# Altium schematic sheet HDA_Connectors.SchDoc: Apalis Evaluation Board 1.1
size A3; Organization: Toradex AG; Address1: Altsagenstrasse 5; Address2: Horw; Address3: 6048; Address4: Switzerland; DocumentNumber: 12; Revision: V1.1; SheetNumber: 12; SheetTotal: 32; PageSetup: Record=PageOptions|CenterHorizontal=True|CenterVertical=True|PrintScale=0.73|XCorrection=1.00|YCorrection=1.00|PrintKind=0|BorderSize=5000000|LeftOffset=0|BottomOffset=0|Orientation=2|PaperLength=1000|PaperWidth=1000|Scale=100|PaperSource=7|PrintQuality=-4|MediaType=1|DitherType=10|PaperKind=A4|PrintScaleMode=1
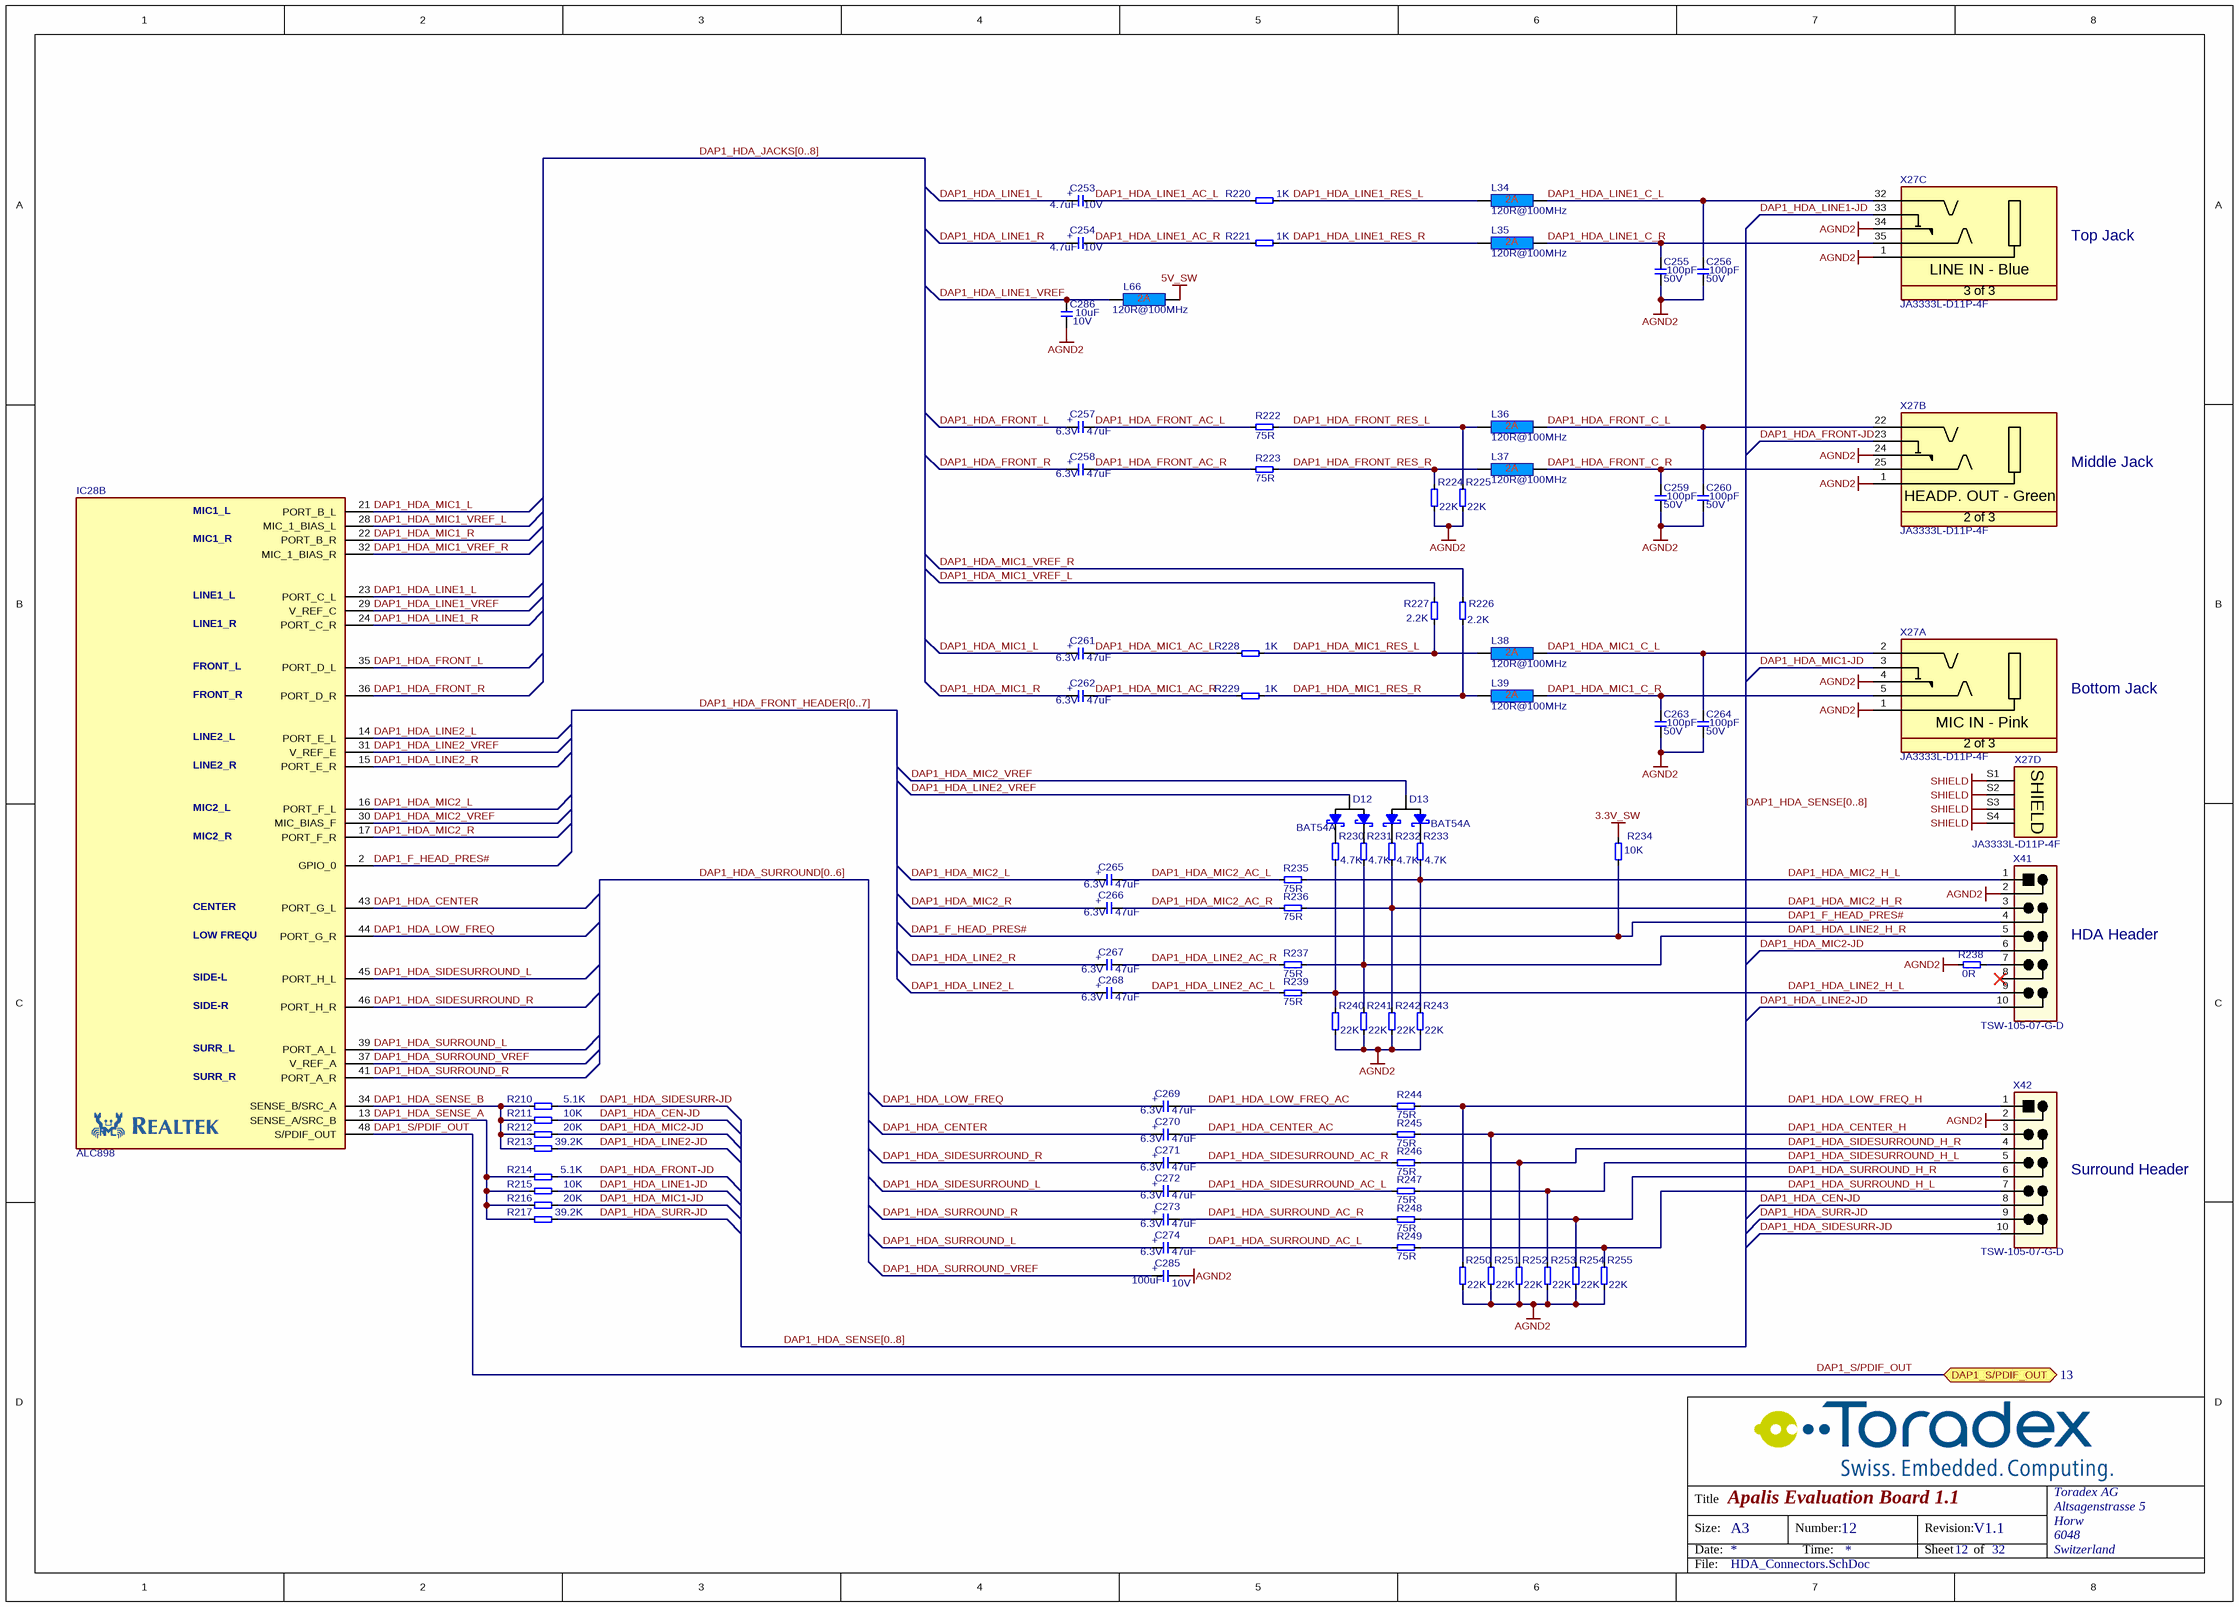
[diagram p0: HDA_Connectors.SchDoc]

## Parts
C253  Rating: 10V  [T_CAPMP3216X180N]  (hidden comment: 4.7uF)
C254  Rating: 10V  [T_CAPMP3216X180N]  (hidden comment: 4.7uF)
C255  Rating: 50V  [CAPC1005X60N]  (hidden comment: 100pF)
C256  Rating: 50V  [CAPC1005X60N]  (hidden comment: 100pF)
C257  Rating: 6.3V  [T_CAPMP3216X180N]  (hidden comment: 47uF)
C258  Rating: 6.3V  [T_CAPMP3216X180N]  (hidden comment: 47uF)
C259  Rating: 50V  [CAPC1005X60N]  (hidden comment: 100pF)
C260  Rating: 50V  [CAPC1005X60N]  (hidden comment: 100pF)
C261  Rating: 6.3V  [T_CAPMP3216X180N]  (hidden comment: 47uF)
C262  Rating: 6.3V  [T_CAPMP3216X180N]  (hidden comment: 47uF)
C263  Rating: 50V  [CAPC1005X60N]  (hidden comment: 100pF)
C264  Rating: 50V  [CAPC1005X60N]  (hidden comment: 100pF)
C265  Rating: 6.3V  [T_CAPMP3216X180N]  (hidden comment: 47uF)
C266  Rating: 6.3V  [T_CAPMP3216X180N]  (hidden comment: 47uF)
C267  Rating: 6.3V  [T_CAPMP3216X180N]  (hidden comment: 47uF)
C268  Rating: 6.3V  [T_CAPMP3216X180N]  (hidden comment: 47uF)
C269  Rating: 6.3V  [T_CAPMP3216X180N]  (hidden comment: 47uF)
C270  Rating: 6.3V  [T_CAPMP3216X180N]  (hidden comment: 47uF)
C271  Rating: 6.3V  [T_CAPMP3216X180N]  (hidden comment: 47uF)
C272  Rating: 6.3V  [T_CAPMP3216X180N]  (hidden comment: 47uF)
C273  Rating: 6.3V  [T_CAPMP3216X180N]  (hidden comment: 47uF)
C274  Rating: 6.3V  [T_CAPMP3216X180N]  (hidden comment: 47uF)
C285  Rating: 10V  [CAPMP3528X210N]  (hidden comment: 100uF)
C286  Rating: 10V  [T_CAPC0603X33N]  (hidden comment: 10uF)
D12  BAT54A  [SOT95P230X110-3N]
D13  BAT54A  [SOT95P230X110-3N]
IC28  ALC898  [TSQFP50P900X900X160-48N]  (part B of 2)
L34  120R@100MHz  [INDC1608X95N]
L35  120R@100MHz  [INDC1608X95N]
L36  120R@100MHz  [INDC1608X95N]
L37  120R@100MHz  [INDC1608X95N]
L38  120R@100MHz  [INDC1608X95N]
L39  120R@100MHz  [INDC1608X95N]
L66  120R@100MHz  [INDC1608X95N]
R210  5.1K  [RESC1005X40N]
R211  10K  [RESC1005X40N]
R212  20K  [RESC1005X40N]
R213  39.2K  [RESC1005X40N]
R214  5.1K  [RESC1005X40N]
R215  10K  [RESC1005X40N]
R216  20K  [RESC1005X40N]
R217  39.2K  [RESC1005X40N]
R220  1K  [RESC1005X40N]
R221  1K  [RESC1005X40N]
R222  75R  [RESC1005X40N]
R223  75R  [RESC1005X40N]
R224  22K  [RESC1005X40N]
R225  22K  [RESC1005X40N]
R226  2.2K  [RESC1005X40N]
R227  2.2K  [RESC1005X40N]
R228  1K  [RESC1005X40N]
R229  1K  [RESC1005X40N]
R230  4.7K  [RESC1005X40N]
R231  4.7K  [RESC1005X40N]
R232  4.7K  [RESC1005X40N]
R233  4.7K  [RESC1005X40N]
R234  10K  [T_RESC0603X30N]
R235  75R  [RESC1005X40N]
R236  75R  [RESC1005X40N]
R237  75R  [RESC1005X40N]
R238  0R  [T_RESC0603X30N]
R239  75R  [RESC1005X40N]
R240  22K  [RESC1005X40N]
R241  22K  [RESC1005X40N]
R242  22K  [RESC1005X40N]
R243  22K  [RESC1005X40N]
R244  75R  [RESC1005X40N]
R245  75R  [RESC1005X40N]
R246  75R  [RESC1005X40N]
R247  75R  [RESC1005X40N]
R248  75R  [RESC1005X40N]
R249  75R  [RESC1005X40N]
R250  22K  [RESC1005X40N]
R251  22K  [RESC1005X40N]
R252  22K  [RESC1005X40N]
R253  22K  [RESC1005X40N]
R254  22K  [RESC1005X40N]
R255  22K  [RESC1005X40N]
X27  JA3333L-D11P-4F  [T_FOXCONN_JA3333L-D11P-4F]  (parts A,B,C,D of 4)
X41  TSW-105-07-G-D  [T_Samtec_TSW-105-07-G-D]
X42  TSW-105-07-G-D  [T_Samtec_TSW-105-07-G-D]

## Ports
DAP1_S/PDIF_OUT (bidir, see 13)

## Nets
3.3V_SW: R234.1
5V_SW: L66.2
AGND2: C255.1 C256.1 C259.1 C260.1 C263.1 C264.1 C285.2 C286.1 R224.1 R225.1 R238.1 R240.1 R241.1 R242.1 R243.1 R250.1 R251.1 R252.1 R253.1 R254.1 R255.1 X27.1 X27.4 X27.24 X27.34 X41.2 X42.2
SHIELD: X27.S1(SHIELD) X27.S2(SHIELD) X27.S3(SHIELD) X27.S4(SHIELD)
DAP1_F_HEAD_PRES#: IC28.2(GPIO_0) R234.2 X41.4
DAP1_HDA_CEN-JD: R211.2 X42.8
DAP1_HDA_CENTER: C270.1 IC28.43(PORT_G_L)
DAP1_HDA_CENTER_AC: C270.2 R245.1
DAP1_HDA_CENTER_H: R245.2 R251.2 X42.3
DAP1_HDA_FRONT-JD: R214.2 X27.23
DAP1_HDA_FRONT_AC_L: C257.2 R222.1
DAP1_HDA_FRONT_AC_R: C258.2 R223.1
DAP1_HDA_FRONT_C_L: C260.2 L36.2 X27.22
DAP1_HDA_FRONT_C_R: C259.2 L37.2 X27.25
DAP1_HDA_FRONT_L: C257.1 IC28.35(PORT_D_L)
DAP1_HDA_FRONT_R: C258.1 IC28.36(PORT_D_R)
DAP1_HDA_FRONT_RES_L: L36.1 R222.2 R225.2
DAP1_HDA_FRONT_RES_R: L37.1 R223.2 R224.2
DAP1_HDA_LINE1-JD: R215.2 X27.33
DAP1_HDA_LINE1_AC_L: C253.2 R220.1
DAP1_HDA_LINE1_AC_R: C254.2 R221.1
DAP1_HDA_LINE1_C_L: C256.2 L34.2 X27.32
DAP1_HDA_LINE1_C_R: C255.2 L35.2 X27.35
DAP1_HDA_LINE1_L: C253.1 IC28.23(PORT_C_L)
DAP1_HDA_LINE1_R: C254.1 IC28.24(PORT_C_R)
DAP1_HDA_LINE1_RES_L: L34.1 R220.2
DAP1_HDA_LINE1_RES_R: L35.1 R221.2
DAP1_HDA_LINE1_VREF: C286.2 IC28.29(V_REF_C) L66.1
DAP1_HDA_LINE2-JD: R213.2 X41.10
DAP1_HDA_LINE2_AC_L: C268.2 R239.1
DAP1_HDA_LINE2_AC_R: C267.2 R237.1
DAP1_HDA_LINE2_H_L: R230.1 R239.2 R240.2 X41.9
DAP1_HDA_LINE2_H_R: R231.1 R237.2 R241.2 X41.5
DAP1_HDA_LINE2_L: C268.1 IC28.14(PORT_E_L)
DAP1_HDA_LINE2_R: C267.1 IC28.15(PORT_E_R)
DAP1_HDA_LINE2_VREF: D12.3 IC28.31(V_REF_E)
DAP1_HDA_LOW_FREQ: C269.1 IC28.44(PORT_G_R)
DAP1_HDA_LOW_FREQ_AC: C269.2 R244.1
DAP1_HDA_LOW_FREQ_H: R244.2 R250.2 X42.1
DAP1_HDA_MIC1-JD: R216.2 X27.3
DAP1_HDA_MIC1_AC_L: C261.2 R228.1
DAP1_HDA_MIC1_AC_R: C262.2 R229.1
DAP1_HDA_MIC1_C_L: C264.2 L38.2 X27.2
DAP1_HDA_MIC1_C_R: C263.2 L39.2 X27.5
DAP1_HDA_MIC1_L: C261.1 IC28.21(PORT_B_L)
DAP1_HDA_MIC1_R: C262.1 IC28.22(PORT_B_R)
DAP1_HDA_MIC1_RES_L: L38.1 R227.1 R228.2
DAP1_HDA_MIC1_RES_R: L39.1 R226.1 R229.2
DAP1_HDA_MIC1_VREF_L: IC28.28(MIC_1_BIAS_L) R227.2
DAP1_HDA_MIC1_VREF_R: IC28.32(MIC_1_BIAS_R) R226.2
DAP1_HDA_MIC2-JD: R212.2 X41.6
DAP1_HDA_MIC2_AC_L: C265.2 R235.1
DAP1_HDA_MIC2_AC_R: C266.2 R236.1
DAP1_HDA_MIC2_H_L: R233.1 R235.2 R243.2 X41.1
DAP1_HDA_MIC2_H_R: R232.1 R236.2 R242.2 X41.3
DAP1_HDA_MIC2_L: C265.1 IC28.16(PORT_F_L)
DAP1_HDA_MIC2_R: C266.1 IC28.17(PORT_F_R)
DAP1_HDA_MIC2_VREF: D13.3 IC28.30(MIC_BIAS_F)
DAP1_HDA_SENSE_A: IC28.13(SENSE_A/SRC_B) R214.1 R215.1 R216.1 R217.1
DAP1_HDA_SENSE_B: IC28.34(SENSE_B/SRC_A) R210.1 R211.1 R212.1 R213.1
DAP1_HDA_SIDESURR-JD: R210.2 X42.10
DAP1_HDA_SIDESURROUND_AC_L: C272.2 R247.1
DAP1_HDA_SIDESURROUND_AC_R: C271.2 R246.1
DAP1_HDA_SIDESURROUND_H_L: R247.2 R253.2 X42.5
DAP1_HDA_SIDESURROUND_H_R: R246.2 R252.2 X42.4
DAP1_HDA_SIDESURROUND_L: C272.1 IC28.45(PORT_H_L)
DAP1_HDA_SIDESURROUND_R: C271.1 IC28.46(PORT_H_R)
DAP1_HDA_SURR-JD: R217.2 X42.9
DAP1_HDA_SURROUND_AC_L: C274.2 R249.1
DAP1_HDA_SURROUND_AC_R: C273.2 R248.1
DAP1_HDA_SURROUND_H_L: R249.2 R255.2 X42.7
DAP1_HDA_SURROUND_H_R: R248.2 R254.2 X42.6
DAP1_HDA_SURROUND_L: C274.1 IC28.39(PORT_A_L)
DAP1_HDA_SURROUND_R: C273.1 IC28.41(PORT_A_R)
DAP1_HDA_SURROUND_VREF: C285.1 IC28.37(V_REF_A)
DAP1_S/PDIF_OUT: IC28.48(S/PDIF_OUT) ; port DAP1_S/PDIF_OUT
NetD12_1: D12.1 R230.2
NetD12_2: D12.2 R231.2
NetD13_1: D13.1 R233.2
NetD13_2: D13.2 R232.2
NetR238_2: R238.2 X41.7

Not connected (* = marked no-connect by the designer): X41 8*

## Buses and harness runs
bus DAP1_HDA_FRONT_HEADER[0..7]
bus DAP1_HDA_JACKS[0..8]
bus DAP1_HDA_SENSE[0..8]
bus DAP1_HDA_SURROUND[0..6]

## Notes on the sheet
- Top Jack
- Middle Jack
- Bottom Jack
- (near X41) HDA Header
- (near X42) Surround Header
- Title
- Size:
- Date:
- A3
- Number:
- Time:
- Revision:
- Sheet
- of
- File:
- (in symbol C-TA-4.7uF-10V-20%-3216) +
- (in symbol C-TA-47uF-6.3V-20%-3216) +
- (in symbol C-TA-100uF-10V-20%-3528) +
- (in symbol CON-Foxconn-JA3333L-D11P-4F, part A) MIC IN - Pink; 2 of 3
- (in symbol CON-Foxconn-JA3333L-D11P-4F, part B) HEADP. OUT - Green; 2 of 3
- (in symbol CON-Foxconn-JA3333L-D11P-4F, part C) LINE IN - Blue; 3 of 3
- (in symbol IC-Realtek-ALC898, part B) MIC1_L; MIC1_R; LINE1_L; LINE1_R; FRONT_L; FRONT_R; LINE2_L; LINE2_R; MIC2_L; MIC2_R; CENTER; LOW FREQU; SIDE-L; SIDE-R; SURR_L; SURR_R

## Library data of the parts
C253 C254 = C-TA-4.7uF-10V-20%-3216: Capacitor TA 4.7uF 10V 20% 3216; Tolerance: 20%; Type: TA; Value: 4.7uF
C255 C256 C259 C260 C263 C264 = C-X7R-100pF-50V-10%-0402: Capacitor Ceramic X7R 100pF 50V 10% 0402; Tolerance: 10%; Type: X7R; Value: 100pF
C257 C258 C261 C262 C265-C274 = C-TA-47uF-6.3V-20%-3216: Capacitor TA 47uF 6.3V 20% 3216; Tolerance: 20%; Type: TA; Value: 47uF
C285 = C-TA-100uF-10V-20%-3528: Capacitor TA 100uF 10V 20% 3528; Tolerance: 20%; Type: TA; Value: 100uF
C286 = C-X5R-10uF-10V-20%-0603: Capacitor Ceramic X5R 10uF 10V 20% 0603; Tolerance: 20%; Type: X5R; Value: 10uF
D12 D13 = D-Philips-BAT54A-Schottky: BAT54A Schottky Diode; Manufacturer Name: Philips; Manufacturer Part No.: BAT54A
IC28 = IC-Realtek-ALC898: HD_AUDIO_CODEC; Manufacturer Part No.: ALC898; Manufacturer Name: Realtek
L34-L39 L66 = L-120R@100MHz-2A-25%-0603: 120R@100MHz 2A EMI FILTER; Tolerance: 25%; Rating: 2A; Value: 120R@100MHz
R210 R214 = R-5.1KR-63mW-1%-0402: Resistor 5.1 Kohm 63mW 1% 0402; Value: 5.1KR; Rating: 63mW; Tolerance: 1%
R211 R215 = R-10KR-63mW-1%-0402: Resistor 10 Kohm 63mW 1% 0402; Value: 10KR; Rating: 63mW; Tolerance: 1%
R212 R216 = R-20KR-63mW-1%-0402: Resistor 20 Kohm 63mW 1% 0402; Value: 20KR; Rating: 63mW; Tolerance: 1%
R213 R217 = R-39.2KR-63mW-1%-0402: Resistor 39.2 Kohm 63mW 1% 0402; Value: 39.2KR; Rating: 63mW; Tolerance: 1%
R220 R221 R228 R229 = R-1KR-63mW-5%-0402: Resistor 1 Kohm 63mW 5% 0402; Rating: 63mW; Tolerance: 5%; Value: 1K
R222 R223 R235-R237 R239 R244-R249 = R-75R-63mW-1%-0402: Resistor 75 ohm 63mW 1% 0402; Rating: 63mW; Tolerance: 1%; Value: 75R
R224 R225 R240-R243 R250-R255 = R-22KR-63mW-5%-0402: Resistor 22 Kohm 63mW 5% 0402; Value: 22KR; Rating: 63mW; Tolerance: 5%
R226 R227 = R-2.2KR-63mW-5%-0402: Resistor 2.2Kohm 63mW 5% 0402; Value: 2.2KR; Rating: 63mW; Tolerance: 5%
R230-R233 = R-4.7kR-63mW-5%-0402: Resistor 4.7 Kohm 63mW 5% 0402; Value: 4.7KR; Rating: 63mW; Tolerance: 5%
R234 = R-10KR-63mW-5%-0603: Resistor 10 Kohm 63mW 5% 0603; Value: 10KR; Rating: 63mW; Tolerance: 5%
R238 = R-0R-63mW-1%-0603: Resistor 0 ohm 63mW 1% 0603; Rating: 63mW; Tolerance: 1%; Value: 0R
X27 = CON-Foxconn-JA3333L-D11P-4F: 3x Audiojack stereo, 3.5mm with sense; No. of ways: 13; Manufacturer Name: Foxconn; Manufacturer Part No.: JA3333L-D11P-4F
X41 X42 = CON-Samtec-TSW-105-07-G-D: Header Male, 2x5 Pins, 2.54mm pitch; Manufacturer Name: Samtec; No. of. ways: 2x5; Pitch: 2.54mm; Manufacturer Part No.: TSW-105-07-G-D